# EAGLE design 812BreakoutSmallDIP (EAGLE 7.5.0)
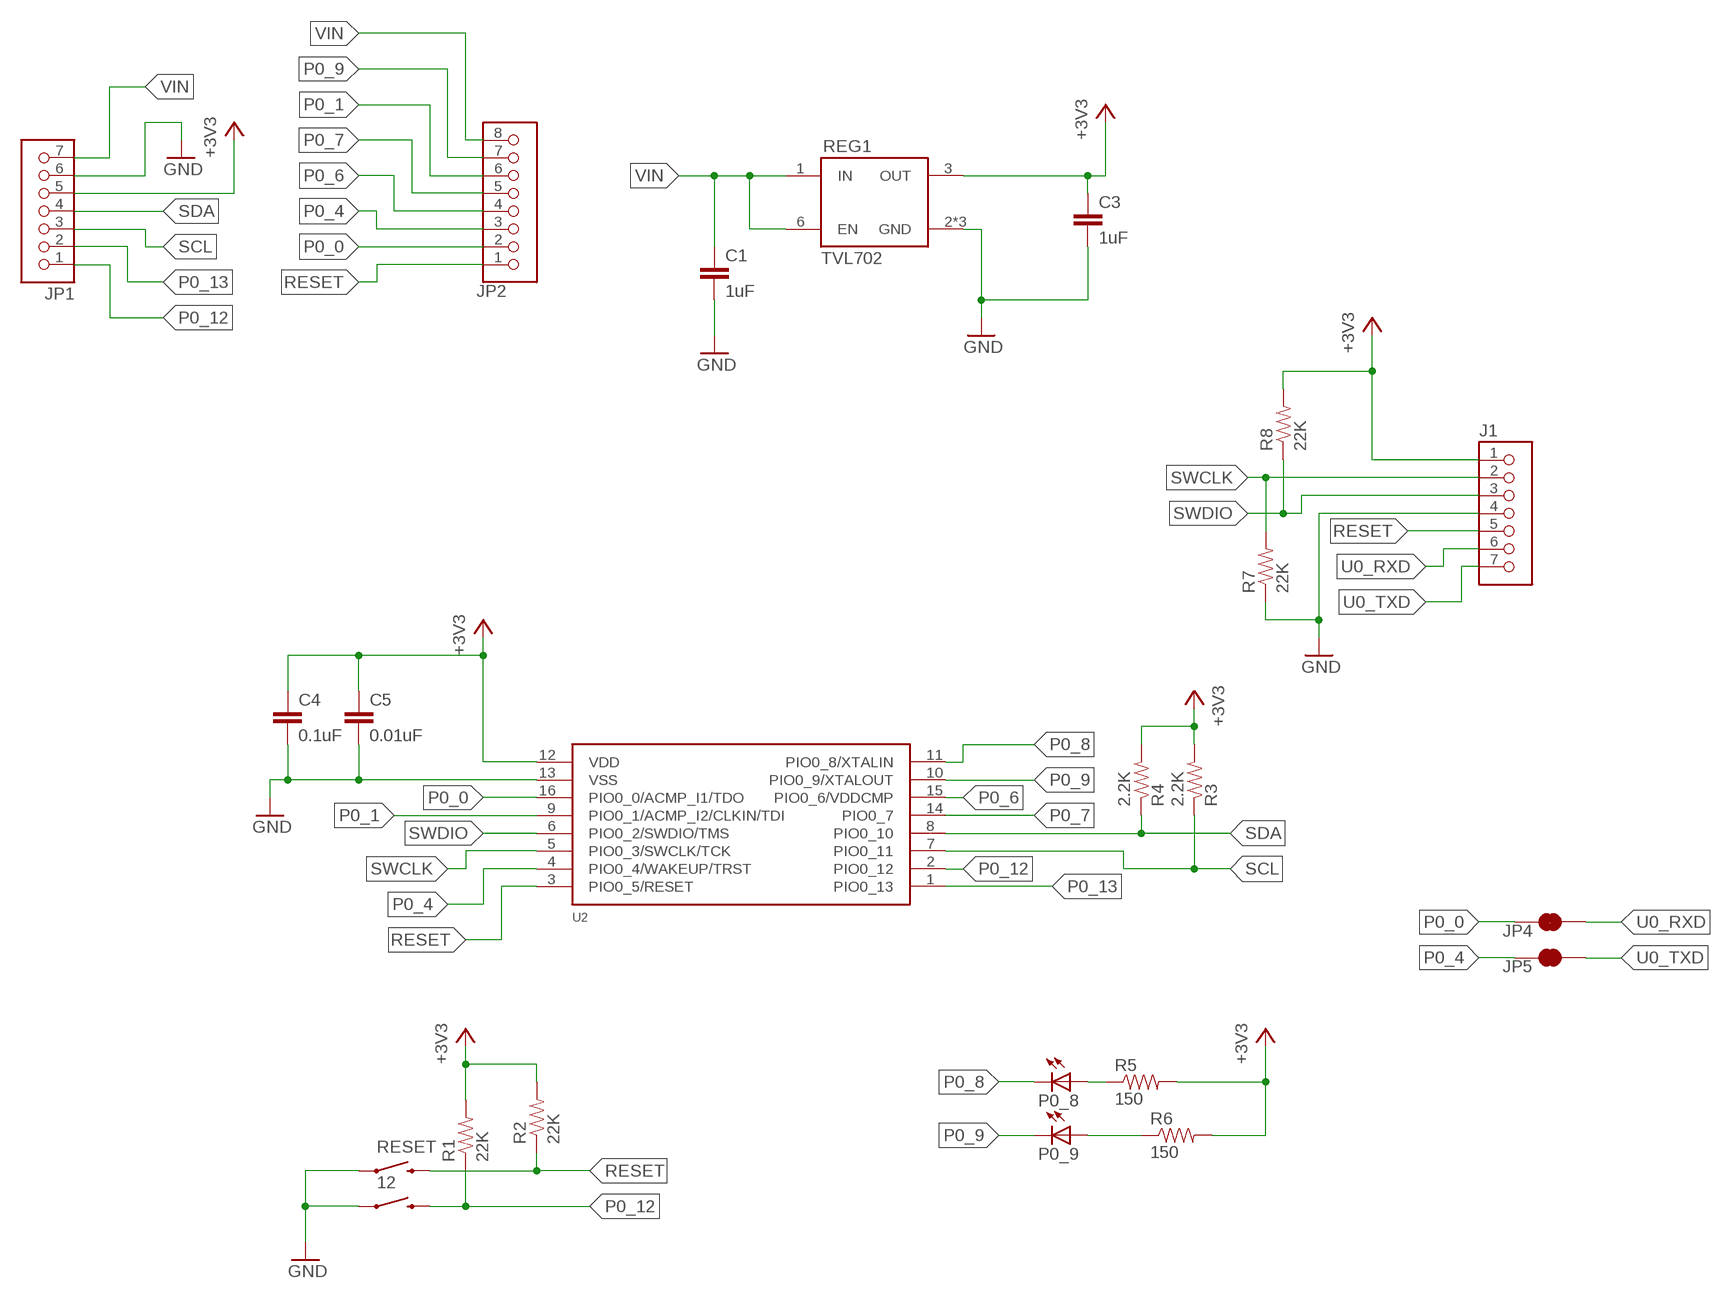
[diagram p0: schematic, sheet 1]

## Parts
12  PTS820J15M  [TACTILE_SWITCH_PTS820]
C1  1uF  C0402  [C0402]
C3  1uF  C0402  [C0402]
C4  0.1uF  C0402  [C0402]
C5  0.01uF  C0402  [C0402]
J1  HEADER_1X7_JST-SH_HORIZONTAL  [JST-SH_HEADER_HORIZONTAL_7]
JP1  HEADER_1X7_100MIL_PTH  [HEADER_100MIL_1X7]
JP2  HEADER_1X8_100MIL_PTH  [HEADER_100MIL_1X8]
JP4  JUMPER-PAD-2-NC_BY_TRACE  [PAD-JUMPER-2-NC_BY_TRACE_YES_SILK]
JP5  JUMPER-PAD-2-NC_BY_TRACE  [PAD-JUMPER-2-NC_BY_TRACE_YES_SILK]
P0_8  LEDCHIPLED_0603  [CHIPLED_0603]
P0_9  LEDCHIPLED_0603  [CHIPLED_0603]
R1  22K  R0402  [R0402]
R2  22K  R0402  [R0402]
R3  2.2K  R0402  [R0402]
R4  2.2K  R0402  [R0402]
R5  150  R0603  [R0603]
R6  150  R0603  [R0603]
R7  22K  R0402  [R0402]
R8  22K  R0402  [R0402]
REG1  TVL702DSE  [WSON-6]
RESET  PTS820J15M  [TACTILE_SWITCH_PTS820]
U2  LPC812_16M101JTB16  [SOT1341-1]

## Nets
+3V3: C3.1 C4.1 C5.1 J1.1 JP1.5 R1.2 R2.2 R3.2 R4.2 R5.2 R6.2 R8.2 REG1.3(OUT) U2.12(VDD)
GND: 12.1 C1.2 C3.2 C4.2 C5.2 J1.4 JP1.6 R7.1 RESET.1 U2.13(VSS)
N$10: P0_9.A R6.1
N$11: P0_8.A R5.1
P0_0: JP2.2 JP4.2 U2.16(PIO0_0/ACMP_I1/TDO)
P0_1: JP2.6 U2.9(PIO0_1/ACMP_I2/CLKIN/TDI)
P0_4: JP2.3 JP5.2 U2.4(PIO0_4/WAKEUP/TRST)
P0_6: JP2.4 U2.15(PIO0_6/VDDCMP)
P0_7: JP2.5 U2.14(PIO0_7)
P0_8: P0_8.C U2.11(PIO0_8/XTALIN)
P0_9: JP2.7 P0_9.C U2.10(PIO0_9/XTALOUT)
P0_12: 12.2 JP1.1 R1.1 U2.2(PIO0_12)
P0_13: JP1.2 U2.1(PIO0_13)
RESET: J1.5 JP2.1 R2.1 RESET.2 U2.3(PIO0_5/RESET)
SCL: JP1.3 R3.1 U2.7(PIO0_11)
SDA: JP1.4 R4.1 U2.8(PIO0_10)
SWCLK: J1.2 R7.2 U2.5(PIO0_3/SWCLK/TCK)
SWDIO: J1.3 R8.1 U2.6(PIO0_2/SWDIO/TMS)
U0_RXD: J1.6 JP4.1
U0_TXD: J1.7 JP5.1
VIN: C1.1 JP1.7 JP2.8 REG1.1(IN) REG1.6(EN)

## Power pins joined to a net without a drawn wire
GND: REG1.2(GND) REG1.4(GND) REG1.5(GND)

## Library data of the parts
12 RESET = heck:PTS820
C1 C3-C5 = heck:C
J1 JP1 = heck:HEADER_1X7
JP2 = heck:HEADER_1X8
JP4 JP5 = SparkFun-Passives:JUMPER-PAD-2-NC_BY_TRACE
P0_8 P0_9 = led:LED: LED OSRAM: - CHIPLED LG R971, LG N971, LY N971, LG Q971, LY Q971, LO R971, LY R971 LH N974, LH R974 LS Q976, LO Q976, LY Q976 LO Q996 - Hyper CHIPLED LW Q18S LB Q993, LB Q99A, LB R99A - SideLED LS A670, LO A670, LY A670, LG A670, LP A670 LB A673, LV A673, LT A673, LW A673 LH A674 LY A675 LS A676, LA A676, LO A676, LY A676, LW A676 LS A679, LY A679, LG A679 - Hyper Micro SIDELED® LS Y876, LA Y876, LO Y876, LY Y876 LT Y87S - SmartLED LW L88C, LW L88S LB L89C, LB L89S, LG L890 LS L89K, LO L89K, LY L89K LS L896, LA L896, LO L896, LY L896 - TOPLED LS T670, LO T670, LY T670, LG T670, LP T670 LSG T670, LSP T670, LSY T670, LOP T670, LYG T670 LG T671, LOG T671, LSG T671 LB T673, LV T673, LT T673, LW T673 LH T674 LS T676, LA T676, LO T676, LY T676, LB T676, LH T676, LSB T676, LW T676 LB T67C, LV T67C, LT T67C, LS T67K, LO T67K, LY T67K, LW E67C LS E67B, LA E67B, LO E67B, LY E67B, LB E67C, LV E67C, LT E67C LW T67C LS T679, LY T679, LG T679 LS T770, LO T770, LY T770, LG T770, LP T770 LB T773, LV T773, LT T773, LW T773 LH T774 LS E675, LA E675, LY E675, LS T675 LS T776, LA T776, LO T776, LY T776, LB T776 LHGB T686 LT T68C, LB T68C - Hyper Mini TOPLED® LB M676 - Mini TOPLED Santana® LG M470 LS M47K, LO M47K, LY M47K Source: http://www.osram.convergy.de LUXEON: - LUMILED® LXK2-PW12-R00, LXK2-PW12-S00, LXK2-PW14-U00, LXK2-PW14-V00 LXK2-PM12-R00, LXK2-PM12-S00, LXK2-PM14-U00 LXK2-PE12-Q00, LXK2-PE12-R00, LXK2-PE12-S00, LXK2-PE14-T00, LXK2-PE14-U00 LXK2-PB12-K00, LXK2-PB12-L00, LXK2-PB12-M00, LXK2-PB14-N00, LXK2-PB14-P00, LXK2-PB14-Q00 LXK2-PR12-L00, LXK2-PR12-M00, LXK2-PR14-Q00, LXK2-PR14-R00 LXK2-PD12-Q00, LXK2-PD12-R00, LXK2-PD12-S00 LXK2-PH12-R00, LXK2-PH12-S00 LXK2-PL12-P00, LXK2-PL12-Q00, LXK2-PL12-R00 Source: www.luxeon.com KINGBRIGHT: KA-3528ASYC Source: www.kingbright.com
R1-R8 = heck:R
REG1 = heck:TVL702
U2 = heck:LPC812_16

## Board
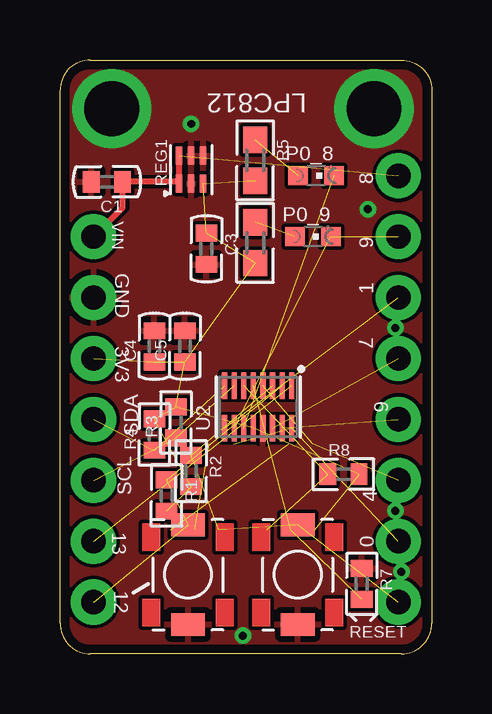
[diagram p1: board, top side]
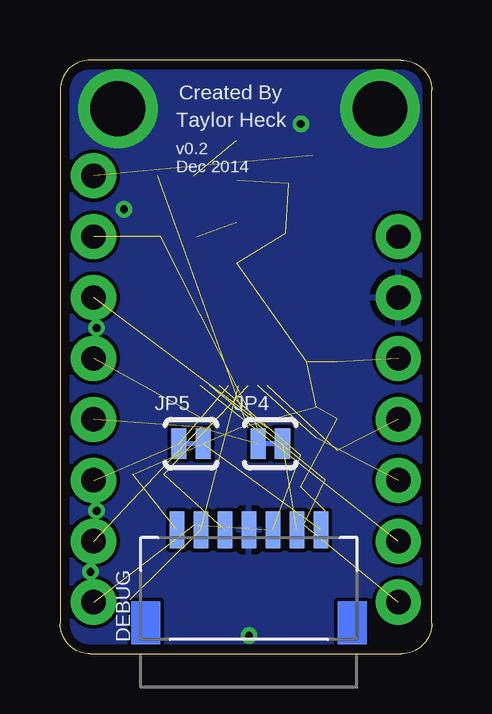
[diagram p2: board, bottom side, seen from below]

Size 15.49 x 24.77 mm. Coordinates in mm from the lower left corner, seen from the top.
Outline: 0,1.27 0,23.5 arc-90 1.27,24.77 14.22,24.77 arc-90 15.49,23.5 15.49,1.27 arc-90 14.22,0 1.27,0 arc-90 0,1.27
Copper layers (1*16): Top 0.0356mm / dielectric 1.5011mm / Bottom 0.0356mm
Design rules "heck": minimum track width 6mil, minimum drill 13mil, track to track 6mil, track to pad 6mil, pad to pad 6mil, via to via 6mil, smd to smd 6mil, copper to edge 15mil, drill to drill 6mil, minimum pad ring 7mil, minimum via ring 7mil, stop-mask expansion 3mil, vias tented up to drill 20mil, thermal gap 10mil

### Footprints (pad centres in the part's own frame; a part is rotated, then mirrored left to right if it is on the bottom)
TACTILE_SWITCH_PTS820 = smd 0.95 x 1.4: 1 -2.075,0; 2 2.075,0
C0402 = smd 0.7 x 0.9: 1 -0.65,0; 2 0.65,0
JST-SH_HEADER_HORIZONTAL_7 = smd 0.6 x 1.55: 1 -3,2; 2 -2,2; 3 -1,2; 4 0,2; 5 1,2; 6 2,2; 7 3,2
HEADER_100MIL_1X7 = drill 1.016 pad 1.88: 1 -7.62,0; 2 -5.08,0; 3 -2.54,0; 4 0,0; 5 2.54,0; 6 5.08,0; 7 7.62,0
HEADER_100MIL_1X8 = drill 1.016 pad 1.88: 1 -8.89,0; 2 -6.35,0; 3 -3.81,0; 4 -1.27,0; 5 1.27,0; 6 3.81,0; 7 6.35,0; 8 8.89,0
PAD-JUMPER-2-NC_BY_TRACE_YES_SILK = smd 0.635 x 1.27: 1 -0.508,0; 2 0.508,0
CHIPLED_0603 = smd 0.8 x 0.8: A 0,-0.75; C 0,0.75
R0402 = smd 0.7 x 0.9: 1 -0.65,0; 2 0.65,0
R0603 = smd 1.1 x 1: 1 -0.85,0; 2 0.85,0
WSON-6 = smd 0.28 x 0.75: 1 -0.5,-0.575; 2 0,-0.575; 3 0.5,-0.575; 4 0.5,0.575; 5 0,0.575; 6 -0.5,0.575
SOT1341-1 = smd 0.22 x 1.07: 1 -1.4,-0.885; 2 -1,-0.885; 3 -0.6,-0.885; 4 -0.2,-0.885; 5 0.2,-0.885; 6 0.6,-0.885; 7 1,-0.885; 8 1.4,-0.885; 9 1.4,0.885; 10 1,0.885; 11 0.6,0.885; 12 0.2,0.885; 13 -0.2,0.885; 14 -0.6,0.885; 15 -1,0.885; 16 -1.4,0.885

### Placement (x,y rotation side)
12  5.33,3.3 90 top
C1  1.96,19.68 180 top
C3  6.1,16.89 270 top
C4  3.94,12.83 90 top
C5  5.21,12.83 90 top
J1  7.62,3.17 0 bottom
JP1  1.4,9.78 90 top
JP2  14.1,11.05 90 top
JP4  6.73,8.76 180 bottom
JP5  10.03,8.76 180 bottom
P0_8  10.67,19.94 270 top
P0_9  10.54,17.4 270 top
R1  4.45,6.6 270 top
R2  5.46,7.62 270 top
R3  4.83,9.65 90 top
R4  3.94,9.14 90 top
R5  8.13,20.57 270 top
R6  8.13,17.14 270 top
R7  12.57,2.92 270 top
R8  11.81,7.49 0 top
REG1  5.46,20.19 0 top
RESET  9.91,3.3 90 top
U2  8.26,10.3 180 top

### Tracks (layer width: path | path; a pad name or v marks a point on that pad's centre or on a via)
+3V3  (13 unrouted)
GND  (via drill 0.33, 2.29)
  other vias: 7.62,0.76 12.83,18.54 13.97,5.97 14.22,3.43 13.97,13.59 2.16,22.73 13.08,22.73 5.46,22.1
  pour Top (rank 6): -0.08,24.59 15.49,24.64 15.49,0.13 -0.08,0.08
  pour Bottom: -0.1,24.59 -0.1,0.08 15.49,0.13 15.49,24.64
N$10  (1 unrouted)
N$11  (1 unrouted)
P0_0  (2 unrouted)
P0_1  (1 unrouted)
P0_4  (2 unrouted)
P0_6  (1 unrouted)
P0_7  (1 unrouted)
P0_8  (1 unrouted)
P0_9  (2 unrouted)
P0_12  (3 unrouted)
P0_13  (1 unrouted)
RESET  (4 unrouted)
SCL  (2 unrouted)
SDA  (2 unrouted)
SWCLK  (2 unrouted)
SWDIO  (2 unrouted)
U0_RXD  (1 unrouted)
U0_TXD  (1 unrouted)
VIN  (1 unrouted)
  Top 0.254: REG1.6 REG1.1 4.89,19.68 C1.1 2.61,18.61 JP1.7

### Text on the board
bPlace: Created By | Taylor Heck | v0.2 / Dec 2014
tNames: LPC812 | 8 | VIN | 9 | GND | 1 | 3V3 | 7 | 6 | SDA | SCL | 4 | 13 | 0
bNames: DEBUG